# Altium schematic sheet interlinkP2B.SchDoc: Board-to-Board P2B
size Legal; CheckedBy: J. Brinton; CompanyName: Signal Laboratories, Inc.; DrawnBy: J. Brinton; Engineer: J. Brinton; Address1: 3479 Edison Way; Address2: Menlo Park CA 94025; Address3: +1 (877) 778-8435; Address4: siglabs.com; DocumentNumber: 45; Revision: 2b; SheetNumber: 46; SheetTotal: 58
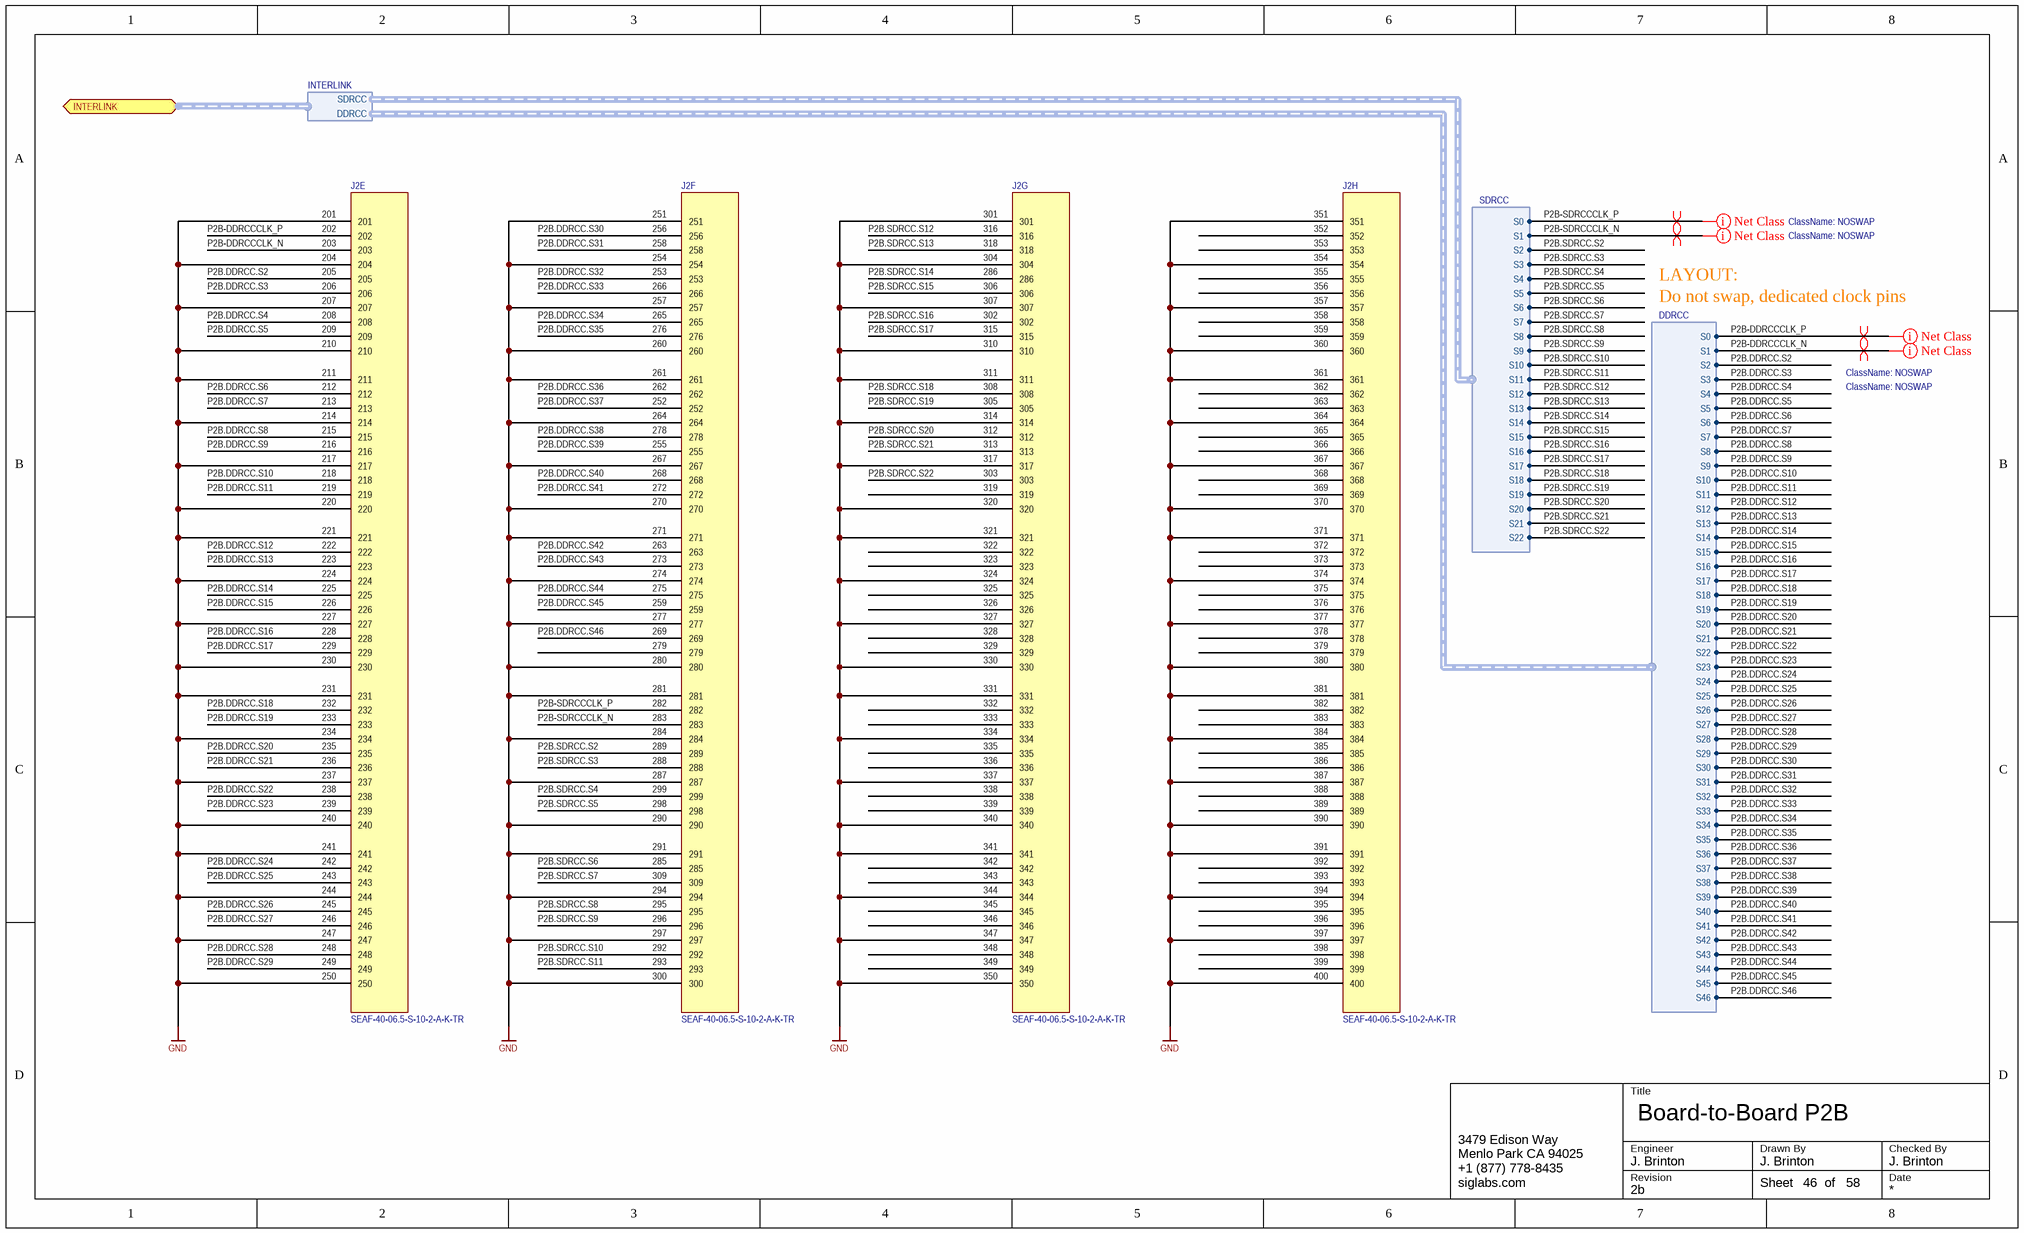
[diagram p0: interlinkP2B.SchDoc]

## Parts
J2  SEAF-40-06.5-S-10-2-A-K-TR  [SEAF-40-06.5-S-10-2-A-K-TR]  (parts E,F,G,H of 8)

## Ports
INTERLINK (harness INTERLINK)

## Harnesses
INTERLINK: DDRCC, SDRCC
DDRCC: S0, S1, S2, S3, S4, S5, S6, S7, S8, S9, S10, S11, S12, S13, S14, S15, S16, S17, S18, S19, S20, S21, S22, S23, S24, S25, S26, S27, S28, S29, S30, S31, S32, S33, S34, S35, S36, S37, S38, S39, S40, S41, S42, S43, S44, S45, S46
SDRCC: S0, S1, S2, S3, S4, S5, S6, S7, S8, S9, S10, S11, S12, S13, S14, S15, S16, S17, S18, S19, S20, S21, S22

## Nets
GND: J2.201 J2.204 J2.207 J2.210 J2.211 J2.214 J2.217 J2.220 J2.221 J2.224 J2.227 J2.230 J2.231 J2.234 J2.237 J2.240 J2.241 J2.244 J2.247 J2.250 J2.251 J2.254 J2.257 J2.260 J2.261 J2.264 J2.267 J2.270 J2.271 J2.274 J2.277 J2.280 J2.281 J2.284 J2.287 J2.290 J2.291 J2.294 J2.297 J2.300 J2.301 J2.304 J2.307 J2.310 J2.311 J2.314 J2.317 J2.320 J2.321 J2.324 J2.327 J2.330 J2.331 J2.334 J2.337 J2.340 J2.341 J2.344 J2.347 J2.350 J2.351 J2.354 J2.357 J2.360 J2.361 J2.364 J2.367 J2.370 J2.371 J2.374 J2.377 J2.380 J2.381 J2.384 J2.387 J2.390 J2.391 J2.394 J2.397 J2.400
P2B-DDRCCCLK_N: J2.203 ; harness DDRCC.S1
P2B-DDRCCCLK_P: J2.202 ; harness DDRCC.S0
P2B-SDRCCCLK_N: J2.283 ; harness SDRCC.S1
P2B-SDRCCCLK_P: J2.282 ; harness SDRCC.S0
P2B.DDRCC.S2: J2.205 ; harness DDRCC.S2
P2B.DDRCC.S3: J2.206 ; harness DDRCC.S3
P2B.DDRCC.S4: J2.208 ; harness DDRCC.S4
P2B.DDRCC.S5: J2.209 ; harness DDRCC.S5
P2B.DDRCC.S6: J2.212 ; harness DDRCC.S6
P2B.DDRCC.S7: J2.213 ; harness DDRCC.S7
P2B.DDRCC.S8: J2.215 ; harness DDRCC.S8
P2B.DDRCC.S9: J2.216 ; harness DDRCC.S9
P2B.DDRCC.S10: J2.218 ; harness DDRCC.S10
P2B.DDRCC.S11: J2.219 ; harness DDRCC.S11
P2B.DDRCC.S12: J2.222 ; harness DDRCC.S12
P2B.DDRCC.S13: J2.223 ; harness DDRCC.S13
P2B.DDRCC.S14: J2.225 ; harness DDRCC.S14
P2B.DDRCC.S15: J2.226 ; harness DDRCC.S15
P2B.DDRCC.S16: J2.228 ; harness DDRCC.S16
P2B.DDRCC.S17: J2.229 ; harness DDRCC.S17
P2B.DDRCC.S18: J2.232 ; harness DDRCC.S18
P2B.DDRCC.S19: J2.233 ; harness DDRCC.S19
P2B.DDRCC.S20: J2.235 ; harness DDRCC.S20
P2B.DDRCC.S21: J2.236 ; harness DDRCC.S21
P2B.DDRCC.S22: J2.238 ; harness DDRCC.S22
P2B.DDRCC.S23: J2.239 ; harness DDRCC.S23
P2B.DDRCC.S24: J2.242 ; harness DDRCC.S24
P2B.DDRCC.S25: J2.243 ; harness DDRCC.S25
P2B.DDRCC.S26: J2.245 ; harness DDRCC.S26
P2B.DDRCC.S27: J2.246 ; harness DDRCC.S27
P2B.DDRCC.S28: J2.248 ; harness DDRCC.S28
P2B.DDRCC.S29: J2.249 ; harness DDRCC.S29
P2B.DDRCC.S30: J2.256 ; harness DDRCC.S30
P2B.DDRCC.S31: J2.258 ; harness DDRCC.S31
P2B.DDRCC.S32: J2.253 ; harness DDRCC.S32
P2B.DDRCC.S33: J2.266 ; harness DDRCC.S33
P2B.DDRCC.S34: J2.265 ; harness DDRCC.S34
P2B.DDRCC.S35: J2.276 ; harness DDRCC.S35
P2B.DDRCC.S36: J2.262 ; harness DDRCC.S36
P2B.DDRCC.S37: J2.252 ; harness DDRCC.S37
P2B.DDRCC.S38: J2.278 ; harness DDRCC.S38
P2B.DDRCC.S39: J2.255 ; harness DDRCC.S39
P2B.DDRCC.S40: J2.268 ; harness DDRCC.S40
P2B.DDRCC.S41: J2.272 ; harness DDRCC.S41
P2B.DDRCC.S42: J2.263 ; harness DDRCC.S42
P2B.DDRCC.S43: J2.273 ; harness DDRCC.S43
P2B.DDRCC.S44: J2.275 ; harness DDRCC.S44
P2B.DDRCC.S45: J2.259 ; harness DDRCC.S45
P2B.DDRCC.S46: J2.269 ; harness DDRCC.S46
P2B.SDRCC.S2: J2.289 ; harness SDRCC.S2
P2B.SDRCC.S3: J2.288 ; harness SDRCC.S3
P2B.SDRCC.S4: J2.299 ; harness SDRCC.S4
P2B.SDRCC.S5: J2.298 ; harness SDRCC.S5
P2B.SDRCC.S6: J2.285 ; harness SDRCC.S6
P2B.SDRCC.S7: J2.309 ; harness SDRCC.S7
P2B.SDRCC.S8: J2.295 ; harness SDRCC.S8
P2B.SDRCC.S9: J2.296 ; harness SDRCC.S9
P2B.SDRCC.S10: J2.292 ; harness SDRCC.S10
P2B.SDRCC.S11: J2.293 ; harness SDRCC.S11
P2B.SDRCC.S12: J2.316 ; harness SDRCC.S12
P2B.SDRCC.S13: J2.318 ; harness SDRCC.S13
P2B.SDRCC.S14: J2.286 ; harness SDRCC.S14
P2B.SDRCC.S15: J2.306 ; harness SDRCC.S15
P2B.SDRCC.S16: J2.302 ; harness SDRCC.S16
P2B.SDRCC.S17: J2.315 ; harness SDRCC.S17
P2B.SDRCC.S18: J2.308 ; harness SDRCC.S18
P2B.SDRCC.S19: J2.305 ; harness SDRCC.S19
P2B.SDRCC.S20: J2.312 ; harness SDRCC.S20
P2B.SDRCC.S21: J2.313 ; harness SDRCC.S21
P2B.SDRCC.S22: J2.303 ; harness SDRCC.S22

Not connected (* = marked no-connect by the designer): J2 279 319 322 323 325 326 328 329 332 333 335 336 338 339 342 343 345 346 348 349 352 353 355 356 358 359 362 363 365 366 368 369 372 373 375 376 378 379 382 383 385 386 388 389 392 393 395 396 398 399

## Layout directives
net class NOSWAP: P2B-DDRCCCLK_N, P2B-DDRCCCLK_P, P2B-SDRCCCLK_N, P2B-SDRCCCLK_P
differential pair: P2B-DDRCCCLK_N, P2B-DDRCCCLK_P, P2B-SDRCCCLK_N, P2B-SDRCCCLK_P

## Notes on the sheet
- Do not swap, dedicated clock pins
- LAYOUT:
- Title
- Engineer
- Revision
- Drawn By
- Checked By
- Date
- Sheet
- of

## Library data of the parts
J2 = SEAF-40-06.5-S-10-2-A-K-TR: Terminal Array Assembly, Surface Mount, 0.050" Pitch, 400 Pins; Manufacturer: Samtec; Manufacturer P/N: SEAF-40-06.5-S-10-2-A-K-TR